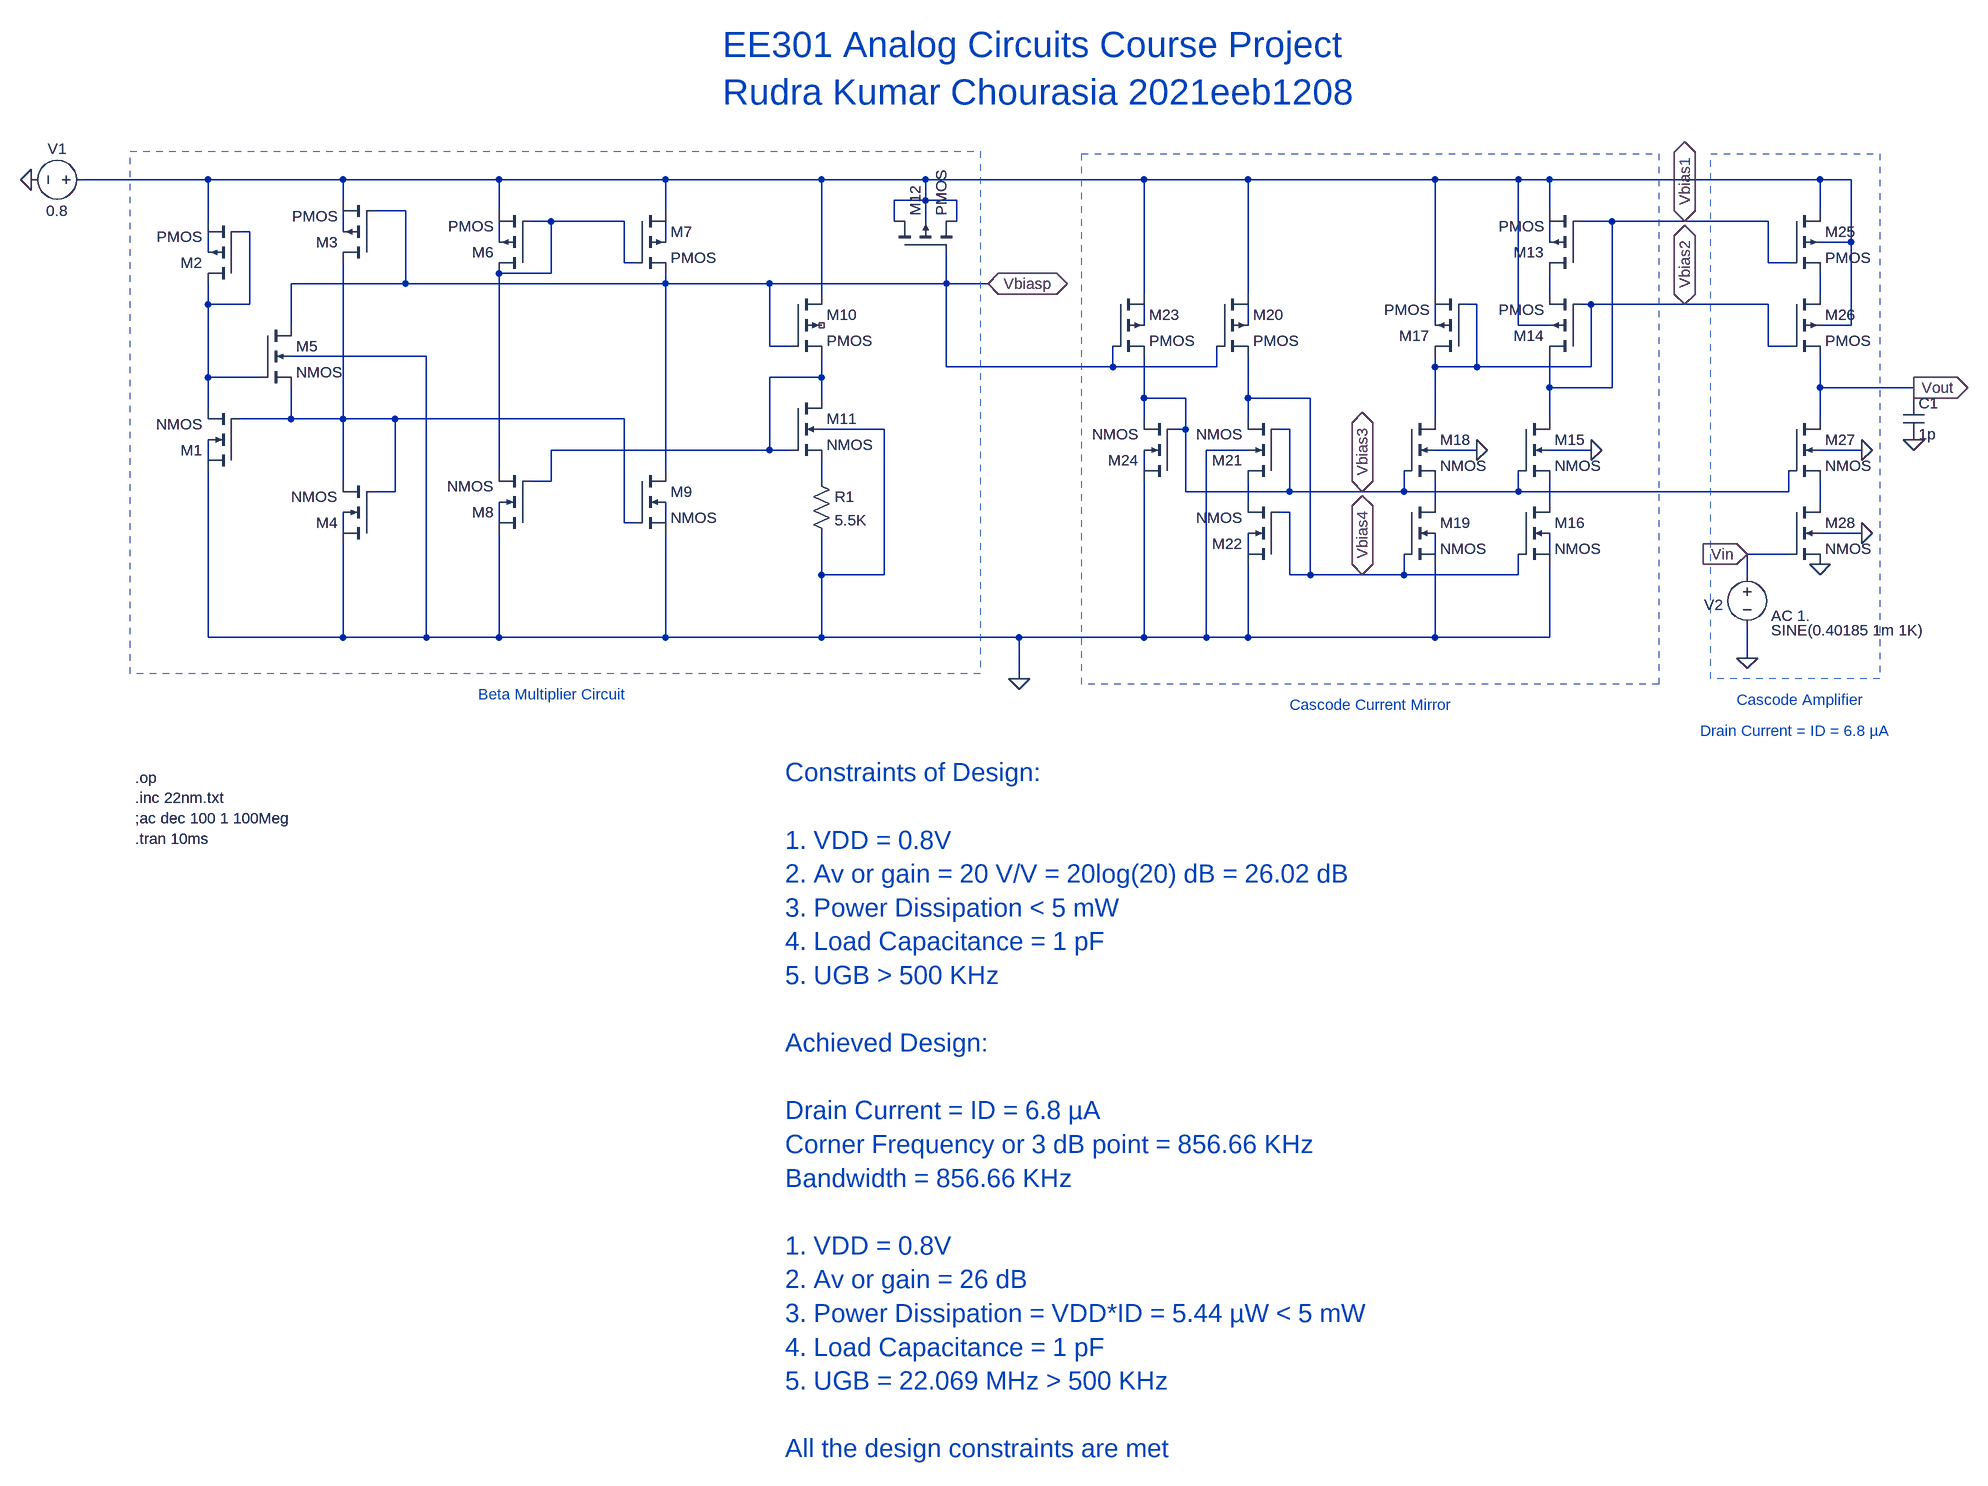
[diagram p0: schematic 22nm_2021eeb1225.asc]
22nm_2021eeb1225.asc, the LTspice schematic file:
Version 4
SHEET 1 2452 1696
WIRE -608 -64 -800 -64
WIRE -400 -64 -608 -64
WIRE -160 -64 -400 -64
WIRE 96 -64 -160 -64
WIRE 336 -64 96 -64
WIRE 496 -64 336 -64
WIRE 832 -64 496 -64
WIRE 992 -64 832 -64
WIRE 1280 -64 992 -64
WIRE 1408 -64 1280 -64
WIRE 1456 -64 1408 -64
WIRE 1872 -64 1456 -64
WIRE 1920 -64 1872 -64
WIRE -400 -32 -400 -64
WIRE 496 -32 496 -64
WIRE 496 -32 448 -32
WIRE 544 -32 496 -32
WIRE -304 -16 -352 -16
WIRE -160 -16 -160 -64
WIRE 96 -16 96 -64
WIRE 1456 -16 1456 -64
WIRE 1872 -16 1872 -64
WIRE -608 0 -608 -64
WIRE -80 0 -112 0
WIRE 32 0 -80 0
WIRE 448 0 448 -32
WIRE 496 0 496 -32
WIRE 544 0 544 -32
WIRE 1552 0 1504 0
WIRE 1664 0 1552 0
WIRE 1792 0 1664 0
WIRE -544 16 -560 16
WIRE -400 16 -400 -16
WIRE -160 32 -160 0
WIRE 96 32 96 0
WIRE 1456 32 1456 0
WIRE 1920 32 1920 -64
WIRE 1920 32 1872 32
WIRE -608 48 -608 16
WIRE 32 64 32 0
WIRE 48 64 32 64
WIRE 1792 64 1792 0
WIRE 1824 64 1792 64
WIRE -80 80 -80 0
WIRE -80 80 -160 80
WIRE -304 96 -304 -16
WIRE -304 96 -480 96
WIRE 96 96 96 80
WIRE 96 96 -304 96
WIRE 256 96 96 96
WIRE 528 96 528 48
WIRE 528 96 256 96
WIRE 592 96 528 96
WIRE 336 112 336 -64
WIRE 832 112 832 -64
WIRE 992 112 992 -64
WIRE 1280 112 1280 -64
WIRE 1456 112 1456 80
WIRE 1872 112 1872 80
WIRE -608 128 -608 96
WIRE -544 128 -544 16
WIRE -544 128 -608 128
WIRE 1344 128 1328 128
WIRE 1520 128 1504 128
WIRE 1664 128 1520 128
WIRE 1792 128 1664 128
WIRE -480 160 -480 96
WIRE 832 160 832 128
WIRE 992 160 992 128
WIRE 1280 160 1280 128
WIRE 1408 160 1408 -64
WIRE 1456 160 1408 160
WIRE 1920 160 1920 32
WIRE 1920 160 1872 160
WIRE 256 192 256 96
WIRE 288 192 256 192
WIRE 1792 192 1792 128
WIRE 1824 192 1792 192
WIRE -272 208 -480 208
WIRE 528 224 528 96
WIRE 784 224 784 192
WIRE 784 224 528 224
WIRE 944 224 944 192
WIRE 944 224 784 224
WIRE 1280 224 1280 208
WIRE 1344 224 1344 128
WIRE 1344 224 1280 224
WIRE 1520 224 1520 128
WIRE 1520 224 1344 224
WIRE -608 240 -608 128
WIRE -528 240 -608 240
WIRE 336 240 336 208
WIRE 336 240 256 240
WIRE 1456 256 1456 208
WIRE 1552 256 1552 0
WIRE 1552 256 1456 256
WIRE 1872 256 1872 208
WIRE 2016 256 1872 256
WIRE 336 272 336 240
WIRE 832 272 832 208
WIRE 896 272 832 272
WIRE 992 272 992 208
WIRE 1088 272 992 272
WIRE 2016 272 2016 256
WIRE -608 288 -608 240
WIRE -480 304 -480 256
WIRE -480 304 -560 304
WIRE -400 304 -400 64
WIRE -400 304 -480 304
WIRE -320 304 -400 304
WIRE 32 304 -320 304
WIRE 832 304 832 272
WIRE 992 304 992 272
WIRE 1280 304 1280 224
WIRE 1456 304 1456 256
WIRE 1872 304 1872 256
WIRE 432 320 336 320
WIRE 896 320 896 272
WIRE 896 320 880 320
WIRE 1056 320 1040 320
WIRE 256 352 256 240
WIRE 256 352 -80 352
WIRE 288 352 256 352
WIRE 992 352 928 352
WIRE 1344 352 1280 352
WIRE 1520 352 1456 352
WIRE 1936 352 1872 352
WIRE -608 368 -608 336
WIRE -160 384 -160 80
WIRE 96 384 96 96
WIRE 832 384 832 352
WIRE -400 400 -400 304
WIRE -80 400 -80 352
WIRE -80 400 -112 400
WIRE 336 400 336 368
WIRE -320 416 -320 304
WIRE -320 416 -352 416
WIRE 896 416 896 320
WIRE 1056 416 1056 320
WIRE 1056 416 896 416
WIRE 1168 416 1056 416
WIRE 1232 416 1232 384
WIRE 1232 416 1168 416
WIRE 1408 416 1408 384
WIRE 1408 416 1232 416
WIRE 1824 416 1824 384
WIRE 1824 416 1408 416
WIRE 992 432 992 400
WIRE 1280 432 1280 400
WIRE 1456 432 1456 400
WIRE 1872 432 1872 400
WIRE 1056 448 1040 448
WIRE -160 464 -160 432
WIRE 32 464 32 304
WIRE 48 464 32 464
WIRE 96 464 96 432
WIRE -400 480 -400 448
WIRE 1936 480 1872 480
WIRE 992 512 992 480
WIRE 1280 512 1280 480
WIRE 1456 512 1456 480
WIRE 1824 512 1760 512
WIRE 336 544 336 480
WIRE 432 544 432 320
WIRE 432 544 336 544
WIRE 1056 544 1056 448
WIRE 1088 544 1088 272
WIRE 1088 544 1056 544
WIRE 1168 544 1088 544
WIRE 1232 544 1232 512
WIRE 1232 544 1168 544
WIRE 1408 544 1408 512
WIRE 1408 544 1232 544
WIRE 1760 544 1760 512
WIRE -608 640 -608 384
WIRE -400 640 -400 496
WIRE -400 640 -608 640
WIRE -272 640 -272 208
WIRE -272 640 -400 640
WIRE -160 640 -160 480
WIRE -160 640 -272 640
WIRE 96 640 96 480
WIRE 96 640 -160 640
WIRE 336 640 336 544
WIRE 336 640 96 640
WIRE 640 640 336 640
WIRE 832 640 832 400
WIRE 832 640 640 640
WIRE 928 640 928 352
WIRE 928 640 832 640
WIRE 992 640 992 528
WIRE 992 640 928 640
WIRE 1280 640 1280 528
WIRE 1280 640 992 640
WIRE 1456 640 1456 528
WIRE 1456 640 1280 640
WIRE 1760 672 1760 624
WIRE 640 704 640 640
FLAG -880 -64 0
FLAG 592 96 Vbiasp
IOPIN 592 96 BiDir
FLAG 640 704 0
FLAG 1168 416 Vbias3
IOPIN 1168 416 BiDir
FLAG 1168 544 Vbias4
IOPIN 1168 544 BiDir
FLAG 1664 0 Vbias1
IOPIN 1664 0 BiDir
FLAG 1664 128 Vbias2
IOPIN 1664 128 BiDir
FLAG 2016 336 0
FLAG 2016 256 Vout
IOPIN 2016 256 Out
FLAG 1344 352 0
FLAG 1520 352 0
FLAG 1936 352 0
FLAG 1872 528 0
FLAG 1760 672 0
FLAG 1936 480 0
FLAG 1760 512 Vin
IOPIN 1760 512 In
DATAFLAG 1792 -64 "$"
DATAFLAG 1760 0 "$"
DATAFLAG 1760 128 "$"
DATAFLAG 1760 416 "$"
DATAFLAG 1872 256 "$"
SYMBOL nmos4 -560 384 R180
SYMATTR InstName M1
SYMATTR Value2 l=44n w=220n
SYMBOL pmos4 -560 96 R180
SYMATTR InstName M2
SYMATTR Value2 l=440n w=220n
SYMBOL voltage -784 -64 R90
WINDOW 0 -32 56 VBottom 2
WINDOW 3 32 56 VTop 2
SYMATTR InstName V1
SYMATTR Value 0.8
SYMBOL pmos4 -352 64 R180
SYMATTR InstName M3
SYMATTR Value2 l=44n w=528n
SYMBOL nmos4 -352 496 R180
SYMATTR InstName M4
SYMATTR Value2 l=22n w=110n
SYMBOL nmos4 -528 160 R0
SYMATTR InstName M5
SYMATTR Value2 l=44n w=88n
SYMBOL pmos4 -112 80 R180
SYMATTR InstName M6
SYMATTR Value2 l=44n w=528n
SYMBOL pmos4 48 -16 R0
SYMATTR InstName M7
SYMATTR Value2 l=44n w=528n
SYMBOL nmos4 -112 480 R180
SYMATTR InstName M8
SYMATTR Value2 l=44n w=220n
SYMBOL nmos4 48 384 R0
SYMATTR InstName M9
SYMATTR Value2 l=44n w=220n
SYMBOL pmos4 288 112 R0
SYMATTR InstName M10
SYMATTR Value2 l=44n w=528n
SYMBOL nmos4 288 272 R0
SYMATTR InstName M11
SYMATTR Value2 l=44n w=660n
SYMBOL Res 320 384 R0
SYMATTR InstName R1
SYMATTR Value 5.5K
SYMBOL pmos4 448 48 R270
SYMATTR InstName M12
SYMATTR Value2 l=1100n w=1100n
SYMBOL pmos4 1504 80 R180
SYMATTR InstName M13
SYMATTR Value2 l=44n w=214.05388n
SYMBOL pmos4 1504 208 R180
SYMATTR InstName M14
SYMATTR Value2 l=44n w=4400n
SYMBOL nmos4 1408 304 R0
SYMATTR InstName M15
SYMATTR Value2 l=440n w=220n
SYMBOL nmos4 1408 432 R0
SYMATTR InstName M16
SYMATTR Value2 l=44n w=2200n
SYMBOL pmos4 1328 208 R180
SYMATTR InstName M17
SYMATTR Value2 l=44.97778n w=25.65811n
SYMBOL nmos4 1232 304 R0
SYMATTR InstName M18
SYMATTR Value2 l=440n w=293.33n
SYMBOL nmos4 1232 432 R0
SYMATTR InstName M19
SYMATTR Value2 l=44n w=2200n
SYMBOL pmos4 944 112 R0
SYMATTR InstName M20
SYMATTR Value2 l=44n w=440n
SYMBOL nmos4 1040 400 R180
SYMATTR InstName M21
SYMATTR Value2 l=44n w=132n
SYMBOL nmos4 1040 528 R180
SYMATTR InstName M22
SYMATTR Value2 l=44n w=1100n
SYMBOL pmos4 784 112 R0
SYMATTR InstName M23
SYMATTR Value2 l=44n w=7868.3n
SYMBOL nmos4 880 400 R180
SYMATTR InstName M24
SYMATTR Value2 l=44n w=17.39833n
SYMBOL pmos4 1824 -16 R0
SYMATTR InstName M25
SYMATTR Value2 l=44n w=6014.9363n
SYMBOL pmos4 1824 112 R0
SYMATTR InstName M26
SYMATTR Value2 l=44n w=6010.4036n
SYMBOL nmos4 1824 304 R0
SYMATTR InstName M27
SYMATTR Value2 l=44n w=4422n
SYMBOL nmos4 1824 432 R0
SYMATTR InstName M28
SYMATTR Value2 l=44n w=2200n
SYMBOL Voltage 1760 528 R0
WINDOW 3 37 101 Left 2
WINDOW 0 -66 62 Left 2
WINDOW 123 37 79 Left 2
SYMATTR Value SINE(0.40185 1m 1K)
SYMATTR InstName V2
SYMATTR Value2 AC 1.
SYMBOL Cap 2000 272 R0
SYMATTR InstName C1
SYMATTR Value 1p
TEXT -192 728 Left 2 ;Beta Multiplier Circuit
TEXT 1056 744 Left 2 ;Cascode Current Mirror
TEXT 1744 736 Left 2 ;Cascode Amplifier
TEXT 184 -272 Left 5 ;EE301 Analog Circuits Course Project\nRudra Kumar Chourasia 2021eeb1208
TEXT -720 856 Left 2 !.op\n.inc 22nm.txt\n;ac dec 100 1 100Meg\n.tran 10ms
TEXT 280 848 Left 4 ;Constraints of Design:\n \n1. VDD = 0.8V\n2. Av or gain = 20 V/V = 20log(20) dB = 26.02 dB\n3. Power Dissipation < 5 mW\n4. Load Capacitance = 1 pF\n5. UGB > 500 KHz\n \nAchieved Design:\n \nDrain Current = ID = 6.8 µA\nCorner Frequency or 3 dB point = 856.66 KHz\nBandwidth = 856.66 KHz\n \n1. VDD = 0.8V\n2. Av or gain = 26 dB \n3. Power Dissipation = VDD*ID = 5.44 µW < 5 mW\n4. Load Capacitance = 1 pF\n5. UGB = 22.069 MHz > 500 KHz\n \nAll the design constraints are met
TEXT 1688 784 Left 2 ;Drain Current = ID = 6.8 µA
RECTANGLE Normal -728 -108 580 696 1
RECTANGLE Normal 736 -104 1624 712 1
RECTANGLE Normal 1704 -104 1964 704 1

The netlist it stands for:
* 22nm_2021eeb1225.asc
M1 0 N015 N003 N016 NMOS l=44n w=220n
M2 N003 N003 N001 N008 PMOS l=440n w=220n
V1 N001 0 0.8
M3 N015 Vbiasp N001 N004 PMOS l=44n w=528n
M4 0 N015 N015 N025 NMOS l=22n w=110n
M5 Vbiasp N003 N015 0 NMOS l=44n w=88n
M6 N002 N002 N001 N005 PMOS l=44n w=528n
M7 N001 N002 Vbiasp N006 PMOS l=44n w=528n
M8 0 N014 N002 N023 NMOS l=44n w=220n
M9 Vbiasp N015 0 N024 NMOS l=44n w=220n
M10 N001 Vbiasp N014 NC_01 PMOS l=44n w=528n
M11 N014 N014 N018 0 NMOS l=44n w=660n
R1 N018 0 5.5K
M12 N001 Vbiasp N001 N001 PMOS l=1100n w=1100n
M13 N009 Vbias1 N001 N007 PMOS l=44n w=214.05388n
M14 Vbias1 Vbias2 N009 N001 PMOS l=44n w=4400n
M15 Vbias1 Vbias3 N021 0 NMOS l=440n w=220n
M16 N021 Vbias4 0 N028 NMOS l=44n w=2200n
M17 Vbias2 Vbias2 N001 N013 PMOS l=44.97778n w=25.65811n
M18 Vbias2 Vbias3 N020 0 NMOS l=440n w=293.33n
M19 N020 Vbias4 0 N027 NMOS l=44n w=2200n
M20 N001 Vbiasp Vbias4 N012 PMOS l=44n w=440n
M21 N019 Vbias3 Vbias4 0 NMOS l=44n w=132n
M22 0 Vbias4 N019 N026 NMOS l=44n w=1100n
M23 N001 Vbiasp Vbias3 N011 PMOS l=44n w=7868.3n
M24 0 Vbias3 Vbias3 N017 NMOS l=44n w=17.39833n
M25 N001 Vbias1 N010 N001 PMOS l=44n w=6014.9363n
M26 N010 Vbias2 Vout N001 PMOS l=44n w=6010.4036n
M27 Vout Vbias3 N022 0 NMOS l=44n w=4422n
M28 N022 Vin 0 0 NMOS l=44n w=2200n
V2 Vin 0 SINE(0.40185 1m 1K) AC 1.
C1 Vout 0 1p
.model NMOS NMOS
.model PMOS PMOS
.lib standard.mos
* Beta Multiplier Circuit
* Cascode Current Mirror
* Cascode Amplifier
* EE301 Analog Circuits Course Project
* Rudra Kumar Chourasia 2021eeb1208
.op
.inc 22nm.txt
;ac dec 100 1 100Meg
.tran 10ms
* Constraints of Design:
* 1. VDD = 0.8V
* 2. Av or gain = 20 V/V = 20log(20) dB = 26.02 dB
* 3. Power Dissipation < 5 mW
* 4. Load Capacitance = 1 pF
* 5. UGB > 500 KHz
* Achieved Design:
* Drain Current = ID = 6.8 µA
* Corner Frequency or 3 dB point = 856.66 KHz
* Bandwidth = 856.66 KHz
* 1. VDD = 0.8V
* 2. Av or gain = 26 dB
* 3. Power Dissipation = VDD*ID = 5.44 µW < 5 mW
* 4. Load Capacitance = 1 pF
* 5. UGB = 22.069 MHz > 500 KHz
* All the design constraints are met
* Drain Current = ID = 6.8 µA
.backanno
.end